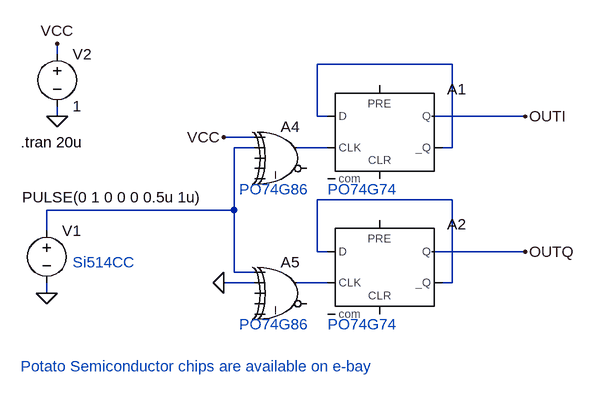
[diagram p0: schematic clock.asc]
clock.asc, the LTspice schematic file:
Version 4
SHEET 1 880 680
WIRE -288 16 -288 0
WIRE 320 32 112 32
WIRE -288 112 -288 96
WIRE 112 112 112 32
WIRE 128 112 112 112
WIRE 432 112 288 112
WIRE 16 144 -32 144
WIRE 16 160 -16 160
WIRE 128 160 80 160
WIRE 320 160 320 32
WIRE 320 160 304 160
WIRE 320 240 112 240
WIRE -16 256 -16 160
WIRE -16 256 -304 256
WIRE -304 288 -304 256
WIRE 112 320 112 240
WIRE 128 320 112 320
WIRE 432 320 288 320
WIRE -16 352 -16 256
WIRE 16 352 -16 352
WIRE 16 368 -32 368
WIRE 128 368 80 368
WIRE 320 368 320 240
WIRE 320 368 304 368
WIRE -304 384 -304 368
FLAG 432 112 OUTI
FLAG 432 320 OUTQ
FLAG -304 384 0
FLAG -32 368 0
FLAG -32 144 VCC
FLAG -288 112 0
FLAG -288 0 VCC
SYMBOL Digital\\dflop 208 64 R0
SYMATTR InstName A1
SYMBOL Digital\\dflop 208 272 R0
SYMATTR InstName A2
SYMBOL voltage -304 272 R0
WINDOW 3 -38 -36 Left 2
WINDOW 123 0 0 Left 0
WINDOW 39 0 0 Left 0
SYMATTR InstName V1
SYMATTR Value PULSE(0 1 0 0 0 0.5u 1u)
SYMBOL Digital\\xor 64 112 R0
SYMATTR InstName A4
SYMBOL Digital\\xor 64 320 R0
SYMATTR InstName A5
SYMBOL voltage -288 0 R0
WINDOW 123 0 0 Left 0
WINDOW 39 0 0 Left 0
SYMATTR InstName V2
SYMATTR Value 1
TEXT -344 152 Left 2 !.tran 20u
TEXT -264 336 Left 2 ;Si514CC
TEXT 128 224 Left 2 ;PO74G74
TEXT 128 432 Left 2 ;PO74G74
TEXT -8 224 Left 2 ;PO74G86
TEXT -8 432 Left 2 ;PO74G86
TEXT -344 496 Left 2 ;Potato Semiconductor chips are available on e-bay

The netlist it stands for:
* clock.asc
A1 N001 0 N003 0 0 N001 OUTI 0 DFLOP
A2 N004 0 N005 0 0 N004 OUTQ 0 DFLOP
V1 N002 0 PULSE(0 1 0 0 0 0.5u 1u)
A4 VCC N002 0 0 0 0 N003 0 XOR
A5 N002 0 0 0 0 0 N005 0 XOR
V2 VCC 0 1
.tran 20u
* Si514CC
* PO74G74
* PO74G74
* PO74G86
* PO74G86
* Potato Semiconductor chips are available on e-bay
.backanno
.end